# Altium schematic sheet Sheet1.SchDoc
size A; SheetNumber: 1; SheetTotal: 1
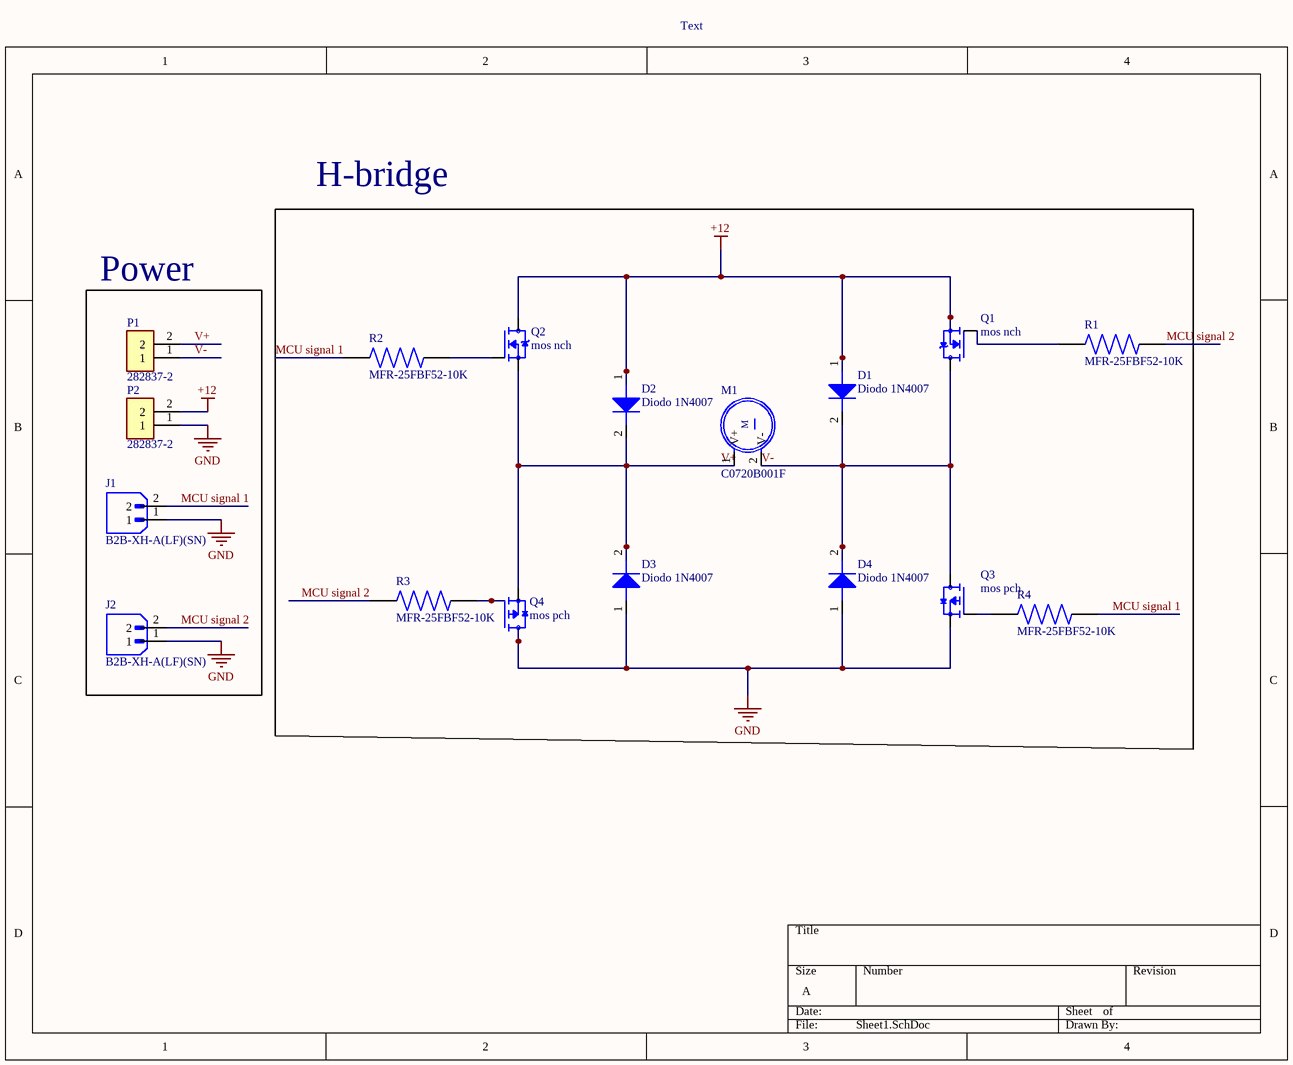
[diagram p0: Sheet1.SchDoc]

## Parts
D1  Diodo 1N4007  [Diodo 1N4007]
D2  Diodo 1N4007  [Diodo 1N4007]
D3  Diodo 1N4007  [Diodo 1N4007]
D4  Diodo 1N4007  [Diodo 1N4007]
J1  B2B-XH-A(LF)(SN)  [JST_B2B-XH-A(LF)(SN)]
J2  B2B-XH-A(LF)(SN)  [JST_B2B-XH-A(LF)(SN)]
M1  C0720B001F  [XDCR_C0720B001F]
P1  282837-2  [TE_282837-2]
P2  282837-2  [TE_282837-2]
Q1  mos nch  [mos nch]
Q2  mos nch  [mos nch]
Q3  mos pch  [mos pch]
Q4  mos pch  [mos pch]
R1  MFR-25FBF52-10K  [RESAD1100W55L680D260]
R2  MFR-25FBF52-10K  [RESAD1100W55L680D260]
R3  MFR-25FBF52-10K  [RESAD1100W55L680D260]
R4  MFR-25FBF52-10K  [RESAD1100W55L680D260]

## Blocks framed on the sheet
H-bridge: D1-D4 M1 Q1-Q4 R1-R4
Power: J1 J2 P1 P2

## Nets
+12: D1.1 D2.1 P2.2 Q1.3(S) Q2.2(D)
GND: D3.1 D4.1 J1.1 J2.1 P2.1 Q3.3(S) Q4.2(D)
MCU signal 1: J1.2 R2.1 R4.2
MCU signal 2: J2.2 R1.2 R3.1
V+: D2.2 D3.2 M1.1(V+) P1.2 Q2.3(S) Q4.3(S)
V-: D1.2 D4.2 M1.2(V-) P1.1 Q1.2(D) Q3.2(D)
NetQ1_1: Q1.1(G) R1.1
NetQ2_1: Q2.1(G) R2.2
NetQ3_1: Q3.1(G) R4.1
NetQ4_1: Q4.1(G) R3.2

## Notes on the sheet
- Text
- (in symbol C0720B001F) M

## Library data of the parts
J1 J2 = B2B-XH-A(LF)(SN): Connector Header Through Hole 2 position 0.098 (2.50mm); MF: JST Sales America Inc.; SnapEDA_Link: https://www.snapeda.com/parts/B2B-XH-A(LF)(SN)/JST+Sales+America+Inc./view-part/?ref=snap; Package: None; Value: *; MP: B2B-XH-A(LF)(SN); Check_prices: https://www.snapeda.com/parts/B2B-XH-A(LF)(SN)/JST+Sales+America+Inc./view-part/?ref=eda
M1 = C0720B001F: DC Motor Vibration, ERM 10000 RPM 3VDC; MF: Jinlong Machinery; Availability: Unavailable; SnapEDA_Link: https://www.snapeda.com/parts/C0720B001F/Jinlong%20Machinery%20%26%20Electronics%2C%20Inc./view-part/645169/?ref=snap; MP: C0720B001F; Value: *; Price: None; Package: Jinlong Machinery
P1 P2 = 282837-2: Ð Ð°Ð·ÑŠÐµÐ¼Ð½Ñ‹Ðµ ÐºÐ»ÐµÐ¼Ð¼Ð½Ñ‹Ðµ ÐºÐ¾Ð»Ð¾Ð´ÐºÐ¸ Ð Ð¾Ð·ÐµÑ‚ÐºÐ° 2 Ð¿Ð¾Ð»Ð¾Ð¶ÐµÐ½Ð¸Ñ 5,08 Ð¼Ð¼ ÐŸÑ€Ð¸Ð¿Ð¾Ð¹ Ð¿Ñ€ÑÐ¼Ð¾Ð¹ Ñ‡ÐµÑ€ÐµÐ· Ð¾Ñ‚Ð²ÐµÑ€ÑÑ‚Ð¸Ðµ 13,5 Ð / ÐºÐ¾Ð½Ñ‚Ð°ÐºÑ‚; MF: TE Connectivity; SnapEDA_Link: https://www.snapeda.com/parts/282837-2/TE+Connectivity+AMP+Connectors/view-part/?ref=snap; Price: None; Check_prices: https://www.snapeda.com/parts/282837-2/TE+Connectivity+AMP+Connectors/view-part/?ref=eda; Purchase-URL: https://pricing.snapeda.com/search/part/282837-2/?ref=eda; MP: 282837-2; Value: *; Availability: In Stock; Package: None
Q1 Q2 = mos nch: N-Channel 55 V 75A (Tc) 170W (Tc) Through Hole TO-220AB; MP: IRF3205ZPBF; MF: Infineon Technologies; SnapEDA_Link: https://www.snapeda.com/parts/IRF3205ZPBF/Infineon+Technologies/view-part/?ref=snap; Availability: In Stock; Package: TO-220 Vishay; Check_prices: https://www.snapeda.com/parts/IRF3205ZPBF/Infineon+Technologies/view-part/?ref=eda; Value: *; Purchase-URL: https://pricing.snapeda.com/search/part/IRF3205ZPBF/?ref=eda; Price: None
Q3 Q4 = mos pch: RoHS Compliant | Low RDS(on) | Industry-leading quality | Dynamic dv/dt Rating | Fast Switching | Fully Avalanche Rated | 175C Operating Temperature | P-Channel MOSFET; MP: IRF9540NPBF; MF: Infineon Technologies; DigiKey-Purchase-URL: https://snapeda.com/shop?store=DigiKey&id=2766497; Package: TO-220 Vishay; SnapEDA_Link: https://www.snapeda.com/parts/IRF9540NPBF/Infineon%20Technologies/view-part/2766497/?ref=snap; Mouser-Purchase-URL: https://snapeda.com/shop?store=Mouser&id=2766497; Arrow_Americas-Purchase-URL: https://snapeda.com/shop?store=Arrow+Americas&id=2766497; Value: *
R1-R4 = MFR-25FBF52-10K: 10.2 kOhms Â±1% 0.25W, 1/4W Through Hole Resistor Axial - Metal Film; MF: Yageo; SnapEDA_Link: https://www.snapeda.com/parts/MFR-25FBF52-10K/Yageo/view-part/?ref=snap; Availability: In Stock; Price: None; Value: *; Check_prices: https://www.snapeda.com/parts/MFR-25FBF52-10K/Yageo/view-part/?ref=eda; Purchase-URL: https://pricing.snapeda.com/search/part/MFR-25FBF52-10K/?ref=eda; MP: MFR-25FBF52-10K; Package: Axial Yageo